# Altium schematic sheet Main2.SchDoc
size A3; DocumentNumber: 2; SheetNumber: 2; SheetTotal: 6
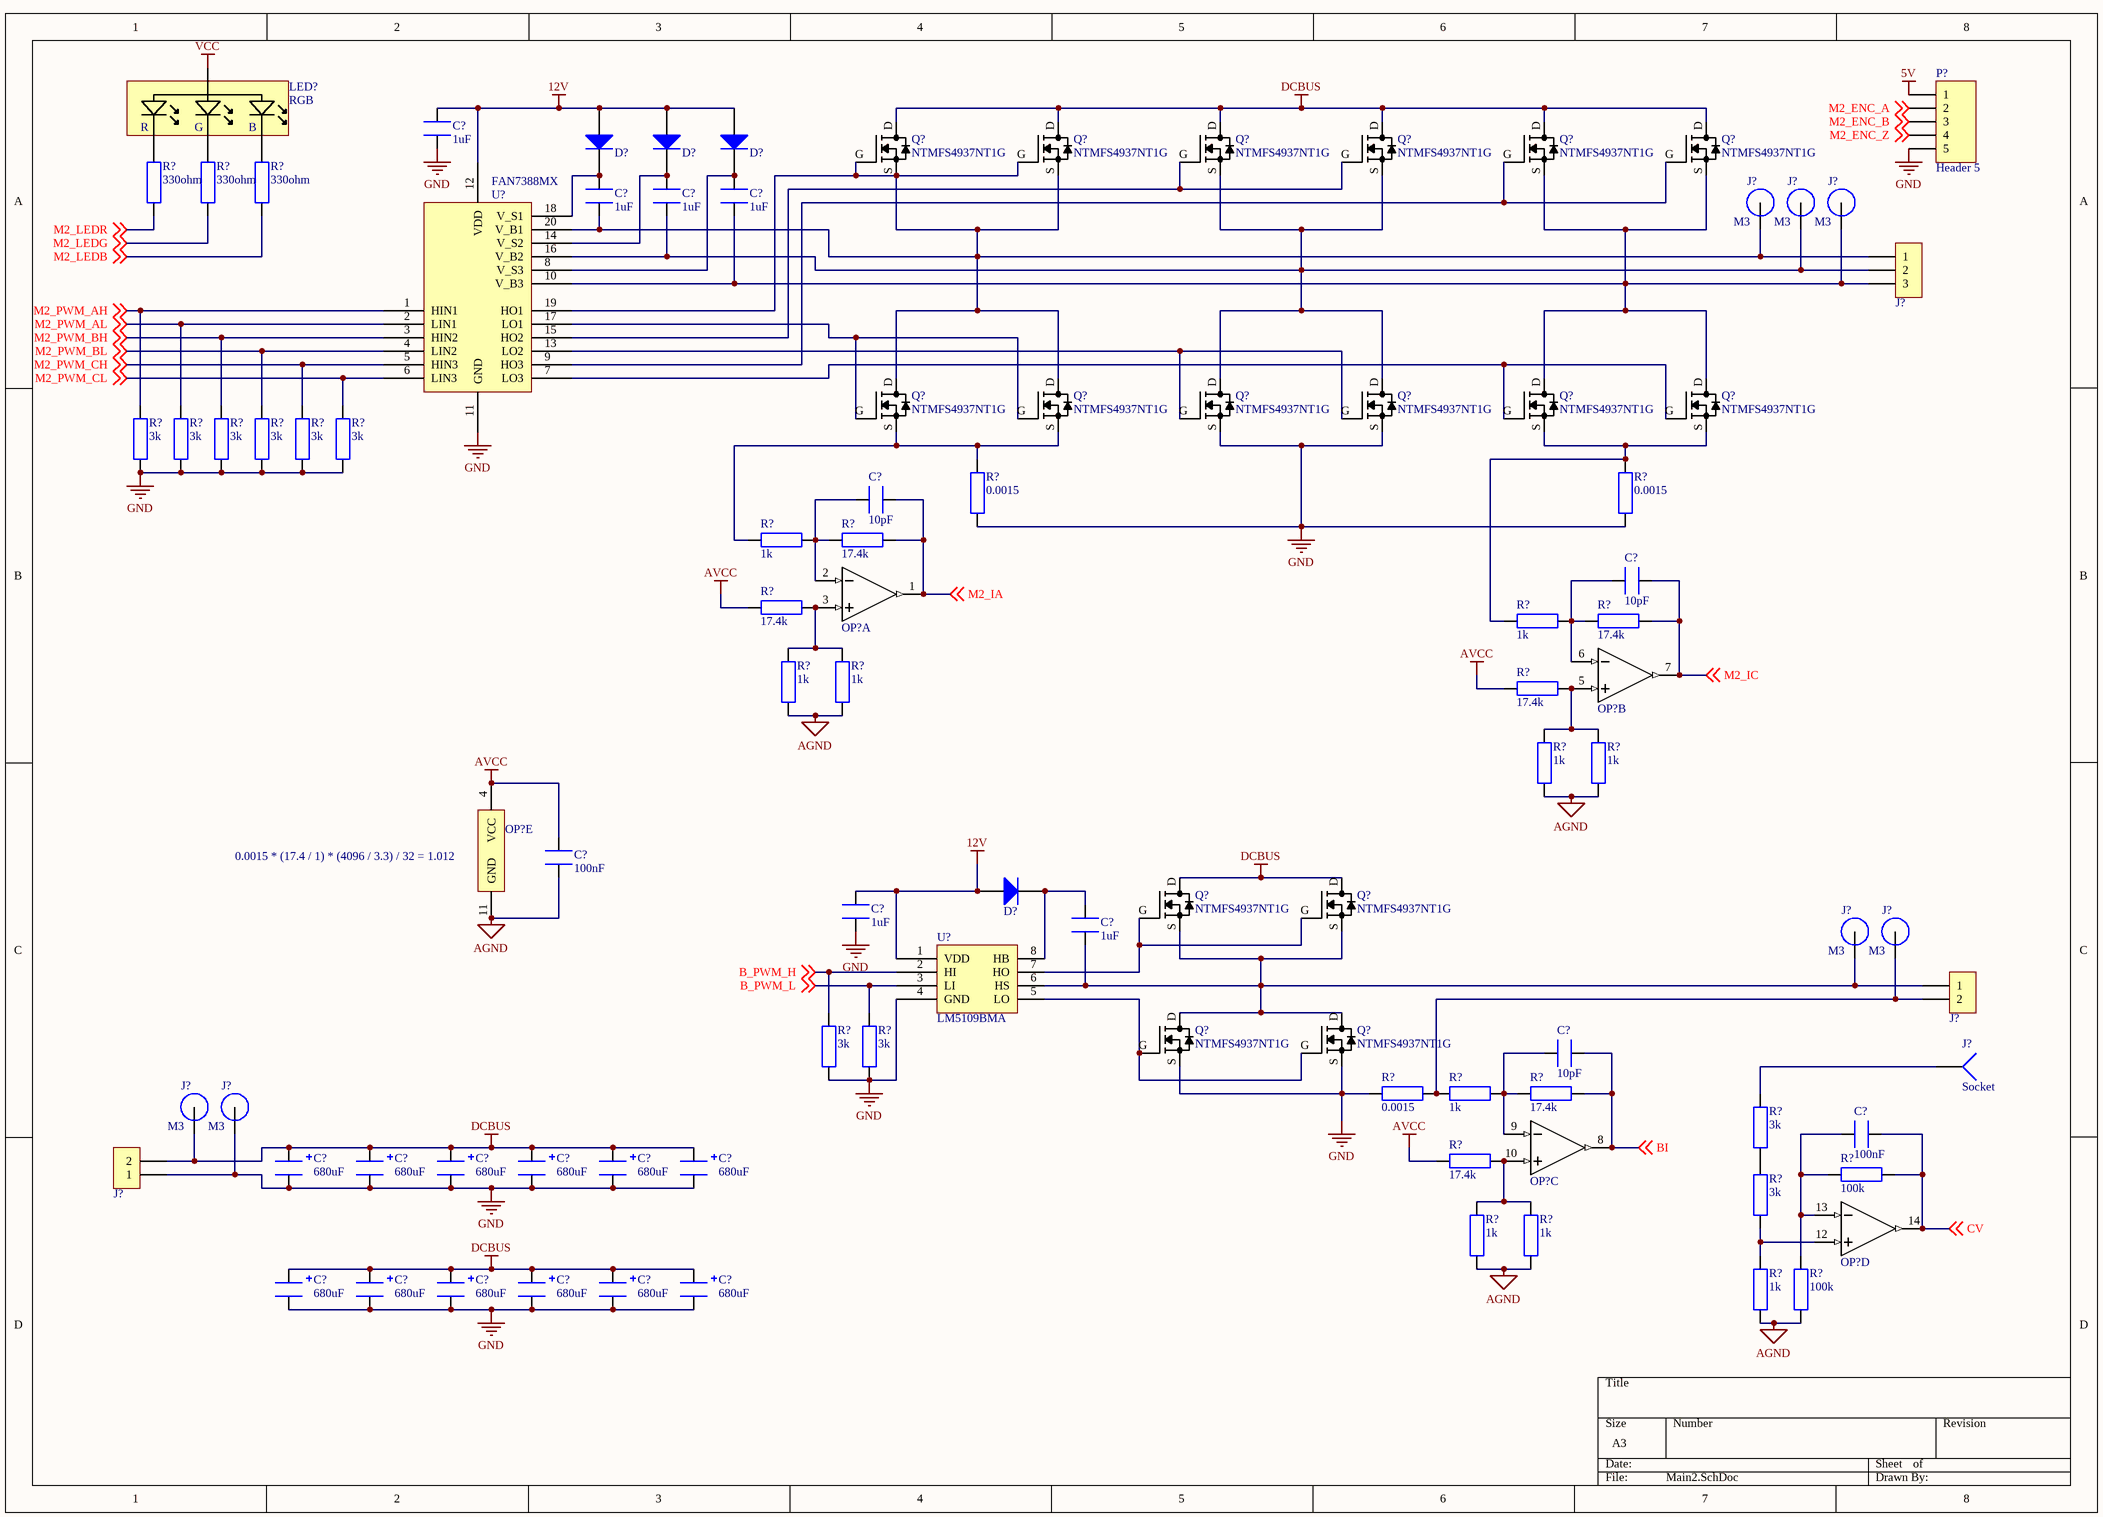
[diagram p0: Main2.SchDoc]

## Parts
(Parts that share a designator on the sheet are numbered #1, #2 ... from top to bottom, then left to right.)
C?#1  value 1uF  [1608[0603]]  (hidden comment: MC0603X105K160)
C?#2  value 1uF  [1608[0603]]  (hidden comment: MC0603X105K160)
C?#3  value 1uF  [1608[0603]]  (hidden comment: MC0603X105K160)
C?#4  value 1uF  [1608[0603]]  (hidden comment: MC0603X105K160)
C?#5  value 10pF  [1608[0603]]  (hidden comment: MC0603N100D500CT)
C?#6  value 10pF  [1608[0603]]  (hidden comment: MC0603N100D500CT)
C?#7  value 100nF  [1608[0603]]  (hidden comment: MC0603B104K160CT)
C?#8  value 1uF  [1608[0603]]  (hidden comment: MC0603X105K160)
C?#9  value 1uF  [1608[0603]]  (hidden comment: MC0603X105K160)
C?#10  value 10pF  [1608[0603]]  (hidden comment: MC0603N100D500CT)
C?#11  value 100nF  [1608[0603]]  (hidden comment: MC0603B104K160CT)
C?#12  value 680uF  [CAPE10.0MM_Rad_10x14mm]  (hidden comment: 35ZLH680MEFC10X23)
C?#13  value 680uF  [CAPE10.0MM_Rad_10x14mm]  (hidden comment: 35ZLH680MEFC10X23)
C?#14  value 680uF  [CAPE10.0MM_Rad_10x14mm]  (hidden comment: 35ZLH680MEFC10X23)
C?#15  value 680uF  [CAPE10.0MM_Rad_10x14mm]  (hidden comment: 35ZLH680MEFC10X23)
C?#16  value 680uF  [CAPE10.0MM_Rad_10x14mm]  (hidden comment: 35ZLH680MEFC10X23)
C?#17  value 680uF  [CAPE10.0MM_Rad_10x14mm]  (hidden comment: 35ZLH680MEFC10X23)
C?#18  value 680uF  [CAPE10.0MM_Rad_10x14mm]  (hidden comment: 35ZLH680MEFC10X23)
C?#19  value 680uF  [CAPE10.0MM_Rad_10x14mm]  (hidden comment: 35ZLH680MEFC10X23)
C?#20  value 680uF  [CAPE10.0MM_Rad_10x14mm]  (hidden comment: 35ZLH680MEFC10X23)
C?#21  value 680uF  [CAPE10.0MM_Rad_10x14mm]  (hidden comment: 35ZLH680MEFC10X23)
C?#22  value 680uF  [CAPE10.0MM_Rad_10x14mm]  (hidden comment: 35ZLH680MEFC10X23)
C?#23  value 680uF  [CAPE10.0MM_Rad_10x14mm]  (hidden comment: 35ZLH680MEFC10X23)
D?#1  RB521S30T1G  [SOD523F]  (value not drawn)
D?#2  RB521S30T1G  [SOD523F]  (value not drawn)
D?#3  RB521S30T1G  [SOD523F]  (value not drawn)
D?#4  RB521S30T1G  [SOD523F]  (value not drawn)
J?#1  M3
J?#2  M3
J?#3  M3
J?#4  MC000051  [MC000051]  (value not drawn)
J?#5  M3
J?#6  M3
J?#7  MC000232  (value not drawn)
J?#8  Socket  [PIN1]
J?#9  M3
J?#10  M3
J?#11  MC000232  (value not drawn)
LED?  RGB  [ASMB-MTB1]
OP?#1  TI_LM324D  [SOIC_14]  (value not drawn)  (part A of 5)
OP?#2  TI_LM324D  [SOIC_14]  (value not drawn)  (part B of 5)
OP?#3  TI_LM324D  [SOIC_14]  (value not drawn)  (part E of 5)
OP?#4  TI_LM324D  [SOIC_14]  (value not drawn)  (part C of 5)
OP?#5  TI_LM324D  [SOIC_14]  (value not drawn)  (part D of 5)
P?  Header 5  [HDR1X5]
Q?#1  NTMFS4937NT1G  [SO8FL]
Q?#2  NTMFS4937NT1G  [SO8FL]
Q?#3  NTMFS4937NT1G  [SO8FL]
Q?#4  NTMFS4937NT1G  [SO8FL]
Q?#5  NTMFS4937NT1G  [SO8FL]
Q?#6  NTMFS4937NT1G  [SO8FL]
Q?#7  NTMFS4937NT1G  [SO8FL]
Q?#8  NTMFS4937NT1G  [SO8FL]
Q?#9  NTMFS4937NT1G  [SO8FL]
Q?#10  NTMFS4937NT1G  [SO8FL]
Q?#11  NTMFS4937NT1G  [SO8FL]
Q?#12  NTMFS4937NT1G  [SO8FL]
Q?#13  NTMFS4937NT1G  [SO8FL]
Q?#14  NTMFS4937NT1G  [SO8FL]
Q?#15  NTMFS4937NT1G  [SO8FL]
Q?#16  NTMFS4937NT1G  [SO8FL]
R?#1  value 330ohm  [RESC1608X55N]  (hidden comment: MCWR06X3300FTL)
R?#2  value 330ohm  [RESC1608X55N]  (hidden comment: MCWR06X3300FTL)
R?#3  value 330ohm  [RESC1608X55N]  (hidden comment: MCWR06X3300FTL)
R?#4  value 3k  [RESC1608X55N]  (hidden comment: MCMR06X3001FTL)
R?#5  value 3k  [RESC1608X55N]  (hidden comment: MCMR06X3001FTL)
R?#6  value 3k  [RESC1608X55N]  (hidden comment: MCMR06X3001FTL)
R?#7  value 3k  [RESC1608X55N]  (hidden comment: MCMR06X3001FTL)
R?#8  value 3k  [RESC1608X55N]  (hidden comment: MCMR06X3001FTL)
R?#9  value 3k  [RESC1608X55N]  (hidden comment: MCMR06X3001FTL)
R?#10  value 0.0015  [RESC6332X70N]  (hidden comment: TLR3A30DR0015FTDG)
R?#11  value 0.0015  [RESC6332X70N]  (hidden comment: TLR3A30DR0015FTDG)
R?#12  value 1k  [RESC1608X55N]  (hidden comment: MCMR06X1001FTL)
R?#13  value 17.4k  [RESC1608X55N]  (hidden comment: ERJ3EKF1742V)
R?#14  value 17.4k  [RESC1608X55N]  (hidden comment: ERJ3EKF1742V)
R?#15  value 1k  [RESC1608X55N]  (hidden comment: MCMR06X1001FTL)
R?#16  value 17.4k  [RESC1608X55N]  (hidden comment: ERJ3EKF1742V)
R?#17  value 17.4k  [RESC1608X55N]  (hidden comment: ERJ3EKF1742V)
R?#18  value 1k  [RESC1608X55N]  (hidden comment: MCMR06X1001FTL)
R?#19  value 1k  [RESC1608X55N]  (hidden comment: MCMR06X1001FTL)
R?#20  value 1k  [RESC1608X55N]  (hidden comment: MCMR06X1001FTL)
R?#21  value 1k  [RESC1608X55N]  (hidden comment: MCMR06X1001FTL)
R?#22  value 3k  [RESC1608X55N]  (hidden comment: MCMR06X3001FTL)
R?#23  value 3k  [RESC1608X55N]  (hidden comment: MCMR06X3001FTL)
R?#24  value 0.0015  [RESC6332X70N]  (hidden comment: TLR3A30DR0015FTDG)
R?#25  value 1k  [RESC1608X55N]  (hidden comment: MCMR06X1001FTL)
R?#26  value 17.4k  [RESC1608X55N]  (hidden comment: ERJ3EKF1742V)
R?#27  value 17.4k  [RESC1608X55N]  (hidden comment: ERJ3EKF1742V)
R?#28  value 3k  [RESC1608X55N]  (hidden comment: MCMR06X3001FTL)
R?#29  value 100k  [RESC1608X55N]  (hidden comment: MCWR06X1003FTL)
R?#30  value 3k  [RESC1608X55N]  (hidden comment: MCMR06X3001FTL)
R?#31  value 100k  [RESC1608X55N]  (hidden comment: MCWR06X1003FTL)
R?#32  value 1k  [RESC1608X55N]  (hidden comment: MCMR06X1001FTL)
R?#33  value 1k  [RESC1608X55N]  (hidden comment: MCMR06X1001FTL)
R?#34  value 1k  [RESC1608X55N]  (hidden comment: MCMR06X1001FTL)
U?#1  FAN7388MX  [SOIC_20]
U?#2  LM5109BMA  [SO8_N]

## Nets
5V: P?.1
12V: C?#1.2 C?#8.2 D?#1.1(A) D?#2.1(A) D?#3.1(A) D?#4.1(A) U?#1.12(VDD) U?#2.1(VDD)
AGND: C?#7.1 OP?#3.11(GND) R?#18.1 R?#19.1 R?#20.1 R?#21.1 R?#31.2 R?#32.1 R?#33.1 R?#34.1
AVCC: C?#7.2 OP?#3.4(VCC) R?#14.2 R?#17.2 R?#27.2
DCBUS: C?#12.1 C?#13.1 C?#14.1 C?#15.1 C?#16.1 C?#17.1 C?#18.1 C?#19.1 C?#20.1 C?#21.1 C?#22.1 C?#23.1 J?#9.1 J?#11.2 Q?#1.D Q?#2.D Q?#3.D Q?#4.D Q?#5.D Q?#6.D Q?#13.D Q?#14.D
GND: C?#1.1 C?#8.1 C?#12.2 C?#13.2 C?#14.2 C?#15.2 C?#16.2 C?#17.2 C?#18.2 C?#19.2 C?#20.2 C?#21.2 C?#22.2 C?#23.2 J?#10.1 J?#11.1 P?.5 Q?#9.S Q?#10.S Q?#15.S Q?#16.S R?#4.1 R?#5.1 R?#6.1 R?#7.1 R?#8.1 R?#9.1 R?#10.1 R?#11.1 R?#22.1 R?#23.1 R?#24.2 U?#1.11(GND) U?#2.4(GND)
VCC: LED?.4(A)
B_PWM_H: R?#22.2 U?#2.2(HI) ; off-sheet B_PWM_H
B_PWM_L: R?#23.2 U?#2.3(LI) ; off-sheet B_PWM_L
BI: C?#10.1 OP?#4.8(OUT) R?#26.1 ; off-sheet BI
CV: C?#11.1 OP?#5.14(OUT) R?#29.1 ; off-sheet CV
M2_ENC_A: P?.2 ; off-sheet M2_ENC_A
M2_ENC_B: P?.3 ; off-sheet M2_ENC_B
M2_ENC_Z: P?.4 ; off-sheet M2_ENC_Z
M2_IA: C?#5.1 OP?#1.1(OUT) R?#13.1 ; off-sheet M2_IA
M2_IC: C?#6.1 OP?#2.7(OUT) R?#16.1 ; off-sheet M2_IC
M2_LEDB: R?#3.2 ; off-sheet M2_LEDB
M2_LEDG: R?#2.2 ; off-sheet M2_LEDG
M2_LEDR: R?#1.2 ; off-sheet M2_LEDR
M2_PWM_AH: R?#4.2 U?#1.1(HIN1) ; off-sheet M2_PWM_AH
M2_PWM_AL: R?#5.2 U?#1.2(LIN1) ; off-sheet M2_PWM_AL
M2_PWM_BH: R?#6.2 U?#1.3(HIN2) ; off-sheet M2_PWM_BH
M2_PWM_BL: R?#7.2 U?#1.4(LIN2) ; off-sheet M2_PWM_BL
M2_PWM_CH: R?#8.2 U?#1.5(HIN3) ; off-sheet M2_PWM_CH
M2_PWM_CL: R?#9.2 U?#1.6(LIN3) ; off-sheet M2_PWM_CL
NetC?#2_1: C?#2.1 J?#1.1 J?#4.1 Q?#1.G Q?#1.S Q?#2.G Q?#2.S Q?#7.D Q?#8.D U?#1.19(HO1) U?#1.20(V_B1)
NetC?#2_2: C?#2.2 D?#1.2(K) U?#1.18(V_S1)
NetC?#3_1: C?#3.1 J?#2.1 J?#4.2 Q?#3.S Q?#4.S Q?#9.D Q?#10.D U?#1.16(V_B2)
NetC?#3_2: C?#3.2 D?#2.2(K) U?#1.14(V_S2)
NetC?#4_1: C?#4.1 J?#3.1 J?#4.3 Q?#5.S Q?#6.S Q?#11.D Q?#12.D U?#1.10(V_B3)
NetC?#4_2: C?#4.2 D?#3.2(K) U?#1.8(V_S3)
NetC?#5_2: C?#5.2 OP?#1.2(IN-) R?#12.1 R?#13.2
NetC?#6_2: C?#6.2 OP?#2.6(IN-) R?#15.1 R?#16.2
NetC?#9_1: C?#9.1 J?#5.1 J?#7.1 Q?#13.S Q?#14.S Q?#15.D Q?#16.D U?#2.6(HS)
NetC?#9_2: C?#9.2 D?#4.2(K) U?#2.8(HB)
NetC?#10_2: C?#10.2 OP?#4.9(IN-) R?#25.1 R?#26.2
NetC?#11_2: C?#11.2 OP?#5.13(IN-) R?#29.2 R?#31.1
NetJ?#6_1: J?#6.1 J?#7.2 R?#24.1 R?#25.2
NetJ?#8_1: J?#8.1 R?#28.2
NetLED?_1: LED?.1(R) R?#1.1
NetLED?_2: LED?.2(G) R?#2.1
NetLED?_3: LED?.3(B) R?#3.1
NetOP?#1_3: OP?#1.3(IN+) R?#14.1 R?#18.2 R?#19.2
NetOP?#2_5: OP?#2.5(IN+) R?#17.1 R?#20.2 R?#21.2
NetOP?#4_10: OP?#4.10(IN+) R?#27.1 R?#32.2 R?#33.2
NetOP?#5_12: OP?#5.12(IN+) R?#30.1 R?#34.2
NetQ?#3_G: Q?#3.G Q?#4.G U?#1.15(HO2)
NetQ?#5_G: Q?#5.G Q?#6.G U?#1.9(HO3)
NetQ?#7_G: Q?#7.G Q?#8.G U?#1.17(LO1)
NetQ?#7_S: Q?#7.S Q?#8.S R?#10.2 R?#12.2
NetQ?#9_G: Q?#9.G Q?#10.G U?#1.13(LO2)
NetQ?#11_G: Q?#11.G Q?#12.G U?#1.7(LO3)
NetQ?#11_S: Q?#11.S Q?#12.S R?#11.2 R?#15.2
NetQ?#13_G: Q?#13.G Q?#14.G U?#2.7(HO)
NetQ?#15_G: Q?#15.G Q?#16.G U?#2.5(LO)
NetR?#28_1: R?#28.1 R?#30.2

## Notes on the sheet
- (near OP?#3) 0.0015 * (17.4 / 1) * (4096 / 3.3) / 32 = 1.012

## Library data of the parts
C?#1-C?#4 C?#8 C?#9 = MC0603X105K160: CAP, MLCC, X5R, 1UF, 16V, 0603
C?#5 C?#6 C?#10 = MC0603N100D500CT: CAP, MLCC, C0G/NP0, 10PF, 50V, 0603
C?#7 C?#11 = MC0603B104K160CT: CAP, MLCC, X7R, 100NF, 16V, 0603
C?#12-C?#23 = 35ZLH680MEFC10X23: CAP, ALU ELEC, 680UF, 35V, RAD
D?#1-D?#4 = RB521S30T1G: DIODE, SCHOTTKY, 200MA, 30V
J?#1-J?#3 J?#5 J?#6 J?#9 J?#10 = M3 Spade Terminal
J?#4 = MC000051: TERMINAL BLOCK, WIRE TO BRD, 3POS, 10AWG
J?#7 J?#11 = MC000232: TERMINAL BLOCK, WIRE TO BRD, 2POS, 6AWG
LED? = ASMB-MTB1-0A3A2: LED, HB, RGB, 0.09W, PLCC-4
OP?#1-OP?#5 = TI_LM324D: OP-AMP, 1.2MHZ, 0.5V/US
P? = Header 5: Header, 5-Pin; LatestRevisionDate: 17-Jul-2002; LatestRevisionNote: Re-released for DXP Platform.; Publisher: Altium Limited
Q?#1-Q?#16 = NTMFS4937NT1G: MOSFET, N CH, 30V, 70A, SO-8 FL
R?#1-R?#3 = MCWR06X3300FTL: RES, THICK FILM, 330 OHM, 1%, 0.1W
R?#4-R?#9 R?#22 R?#23 R?#28 R?#30 = MCMR06X3001FTL: RESISTOR, 0603, 3K, 1%, ANTI SULFUR
R?#10 R?#11 R?#24 = TLR3A30DR0015FTDG: Shunt Resistor R0015
R?#12 R?#15 R?#18-R?#21 R?#25 R?#32-R?#34 = MCMR06X1001FTL: RESISTOR, CERAMIC, 1K, 0.1W, 1%
R?#13 R?#14 R?#16 R?#17 R?#26 R?#27 = ERJ3EKF1742V: RESISTOR, 0603, 17K4 1%, 0.1W
R?#29 R?#31 = MCWR06X1003FTL: RES, THICK FILM, 100KOHM, 1%, 0.1W
U?#1 = FAN7388MX: MOSFET DRIVER, 3 HALF BRIDGE
U?#2 = LM5109BMA: DRIVER, HALF BRIDGE, 1A PK, SOIC8
J?#8 = Socket: LatestRevisionDate: 17-Jul-2002; LatestRevisionNote: Re-released for DXP Platform.; Publisher: Altium Limited